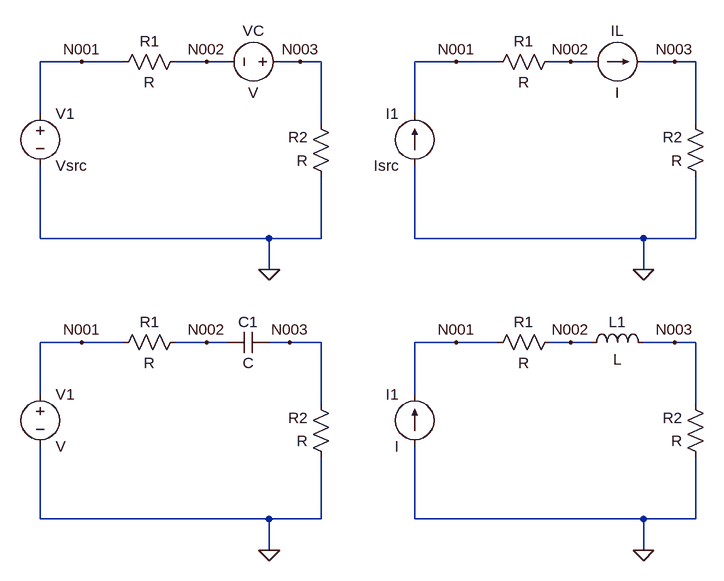
[diagram p0: schematic nodal_analysis_exp.asc]
nodal_analysis_exp.asc, the LTspice schematic file:
Version 4
SHEET 1 1140 680
WIRE 176 -400 112 -400
WIRE 240 -400 176 -400
WIRE 368 -400 320 -400
WIRE 400 -400 368 -400
WIRE 512 -400 480 -400
WIRE 544 -400 512 -400
WIRE 752 -400 688 -400
WIRE 816 -400 752 -400
WIRE 928 -400 896 -400
WIRE 960 -400 928 -400
WIRE 1088 -400 1040 -400
WIRE 1120 -400 1088 -400
WIRE 112 -320 112 -400
WIRE 688 -320 688 -400
WIRE 544 -304 544 -400
WIRE 1120 -304 1120 -400
WIRE 112 -128 112 -240
WIRE 464 -128 112 -128
WIRE 544 -128 544 -224
WIRE 544 -128 464 -128
WIRE 688 -128 688 -240
WIRE 1040 -128 688 -128
WIRE 1120 -128 1120 -224
WIRE 1120 -128 1040 -128
WIRE 464 -80 464 -128
WIRE 1040 -80 1040 -128
WIRE 176 32 112 32
WIRE 240 32 176 32
WIRE 368 32 320 32
WIRE 400 32 368 32
WIRE 496 32 464 32
WIRE 544 32 496 32
WIRE 752 32 688 32
WIRE 816 32 752 32
WIRE 928 32 896 32
WIRE 960 32 928 32
WIRE 1088 32 1040 32
WIRE 1120 32 1088 32
WIRE 112 112 112 32
WIRE 688 112 688 32
WIRE 544 128 544 32
WIRE 1120 128 1120 32
WIRE 112 304 112 192
WIRE 464 304 112 304
WIRE 544 304 544 208
WIRE 544 304 464 304
WIRE 688 304 688 192
WIRE 1040 304 688 304
WIRE 1120 304 1120 208
WIRE 1120 304 1040 304
WIRE 464 352 464 304
WIRE 1040 352 1040 304
FLAG 464 352 0
FLAG 176 32 N001
FLAG 368 32 N002
FLAG 496 32 N003
FLAG 1040 352 0
FLAG 752 32 N001
FLAG 928 32 N002
FLAG 1088 32 N003
FLAG 464 -80 0
FLAG 176 -400 N001
FLAG 368 -400 N002
FLAG 512 -400 N003
FLAG 1040 -80 0
FLAG 752 -400 N001
FLAG 928 -400 N002
FLAG 1088 -400 N003
SYMBOL voltage 112 96 R0
SYMATTR InstName V1
SYMBOL res 336 16 R90
WINDOW 0 0 56 VBottom 2
WINDOW 3 32 56 VTop 2
SYMATTR InstName R1
SYMBOL res 560 224 R180
WINDOW 0 36 76 Left 2
WINDOW 3 36 40 Left 2
SYMATTR InstName R2
SYMBOL cap 464 16 R90
WINDOW 0 0 32 VBottom 2
WINDOW 3 32 32 VTop 2
SYMATTR InstName C1
SYMBOL res 912 16 R90
WINDOW 0 0 56 VBottom 2
WINDOW 3 32 56 VTop 2
SYMATTR InstName R1
SYMBOL res 1136 224 R180
WINDOW 0 36 76 Left 2
WINDOW 3 36 40 Left 2
SYMATTR InstName R2
SYMBOL current 688 192 R180
WINDOW 0 24 80 Left 2
WINDOW 3 24 0 Left 2
SYMATTR InstName I1
SYMBOL ind 944 48 R270
WINDOW 0 32 56 VTop 2
WINDOW 3 5 56 VBottom 2
SYMATTR InstName L1
SYMBOL voltage 112 -336 R0
SYMATTR InstName V1
SYMATTR Value Vsrc
SYMBOL res 336 -416 R90
WINDOW 0 0 56 VBottom 2
WINDOW 3 32 56 VTop 2
SYMATTR InstName R1
SYMBOL res 560 -208 R180
WINDOW 0 36 76 Left 2
WINDOW 3 36 40 Left 2
SYMATTR InstName R2
SYMBOL voltage 496 -400 R90
WINDOW 0 -32 56 VBottom 2
WINDOW 3 32 56 VTop 2
SYMATTR InstName VC
SYMBOL res 912 -416 R90
WINDOW 0 0 56 VBottom 2
WINDOW 3 32 56 VTop 2
SYMATTR InstName R1
SYMBOL res 1136 -208 R180
WINDOW 0 36 76 Left 2
WINDOW 3 36 40 Left 2
SYMATTR InstName R2
SYMBOL current 688 -240 R180
WINDOW 0 24 80 Left 2
WINDOW 3 24 0 Left 2
SYMATTR InstName I1
SYMATTR Value Isrc
SYMBOL current 960 -400 R270
WINDOW 0 32 40 VTop 2
WINDOW 3 -32 40 VBottom 2
SYMATTR InstName IL

The netlist it stands for:
* nodal_analysis_exp.asc
V1 N001 0 V
R1 N002 N001 R
R2 0 N003 R
C1 N003 N002 C
R1 N002 N001 R
R2 0 N003 R
I1 0 N001 I
L1 N002 N003 L
V1 N001 0 Vsrc
R1 N002 N001 R
R2 0 N003 R
VC N003 N002 V
R1 N002 N001 R
R2 0 N003 R
I1 0 N001 Isrc
IL N002 N003 I
.backanno
.end